# Altium schematic sheet USB_UART_V1.4úĘ1úę.SchDoc
size A4
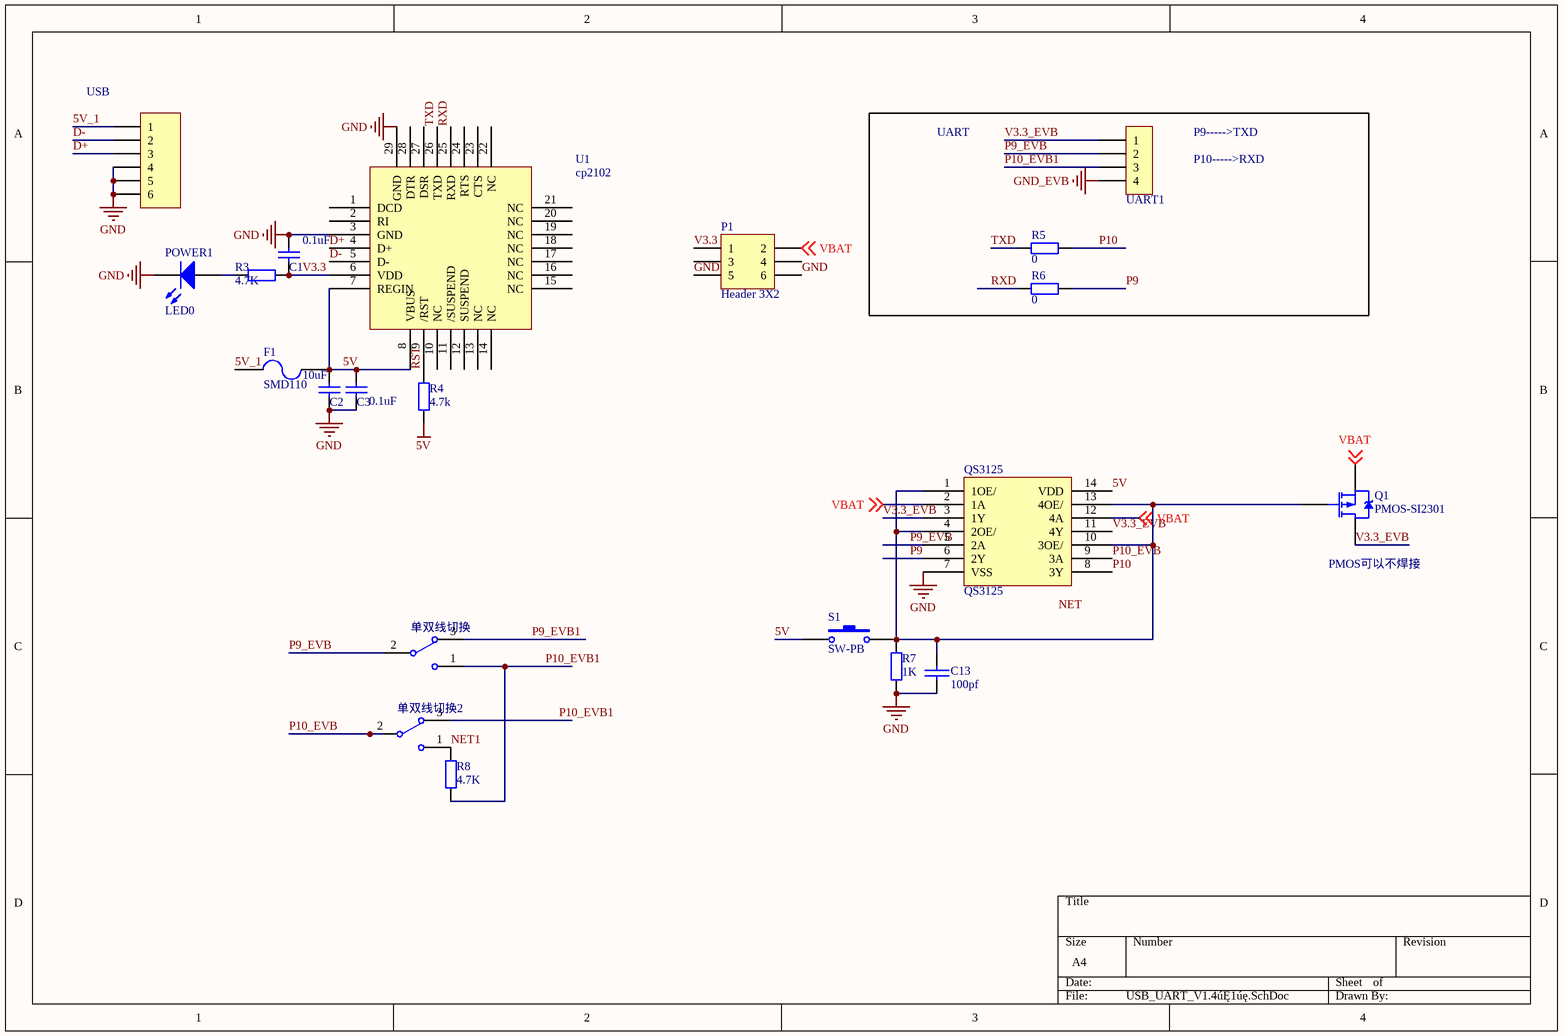
[diagram p0: USB_UART_V1.4úĘ1úę.SchDoc]

## Parts
C1  0.1uF  [C0603]
C2  10uF  [C0603]
C3  0.1uF  [C0603]
C13  100pf  [C0603]
F1  SMD110  [1812]
P1  Header 3X2  [HDR2X3]
POWER1  LED0  [LED0603]
Q1  PMOS-SI2301  [Pmos si2301]
QS3125  QS3125
R3  4.7K  [C0603]
R4  4.7k  [C0603]
R5  value 0  [C0603]  (hidden comment: 4.7k)
R6  value 0  [C0603]  (hidden comment: 4.7k)
R7  value 1K  [C0603]  (hidden comment: 4.7k)
R8  4.7k  [C0603]
S1  SW-PB  [SPST-2]
U1  cp2102  [CP2102]
UART1  CON4  [HDR1X4]  (value not drawn)
USB  MHDR1X6  [USB 公口]  (value not drawn)
单双线切换  SW-SPDT  [HDR1X3]  (value not drawn)
单双线切换2  SW-SPDT  [HDR1X3]  (value not drawn)

## Nets
5V: C2.2 C3.2 F1.1 QS3125.14(VDD) R4.1 S1.1 U1.7(REGIN) U1.8(VBUS)
GND: C1.2 C2.1 C3.1 C13.2 P1.5 P1.6 POWER1.2(K) QS3125.7(VSS) R7.2 U1.3(GND) U1.29(GND) USB.4 USB.5 USB.6
GND_EVB: UART1.4
5V_1: F1.2 USB.1
D+: U1.4(D+) USB.3
D-: U1.5(D-) USB.2
NET1: R8.1 单双线切换2.1
P9: QS3125.6(2Y) R6.2
P9_EVB: QS3125.5(2A) UART1.2 单双线切换.2
P9_EVB1: 单双线切换.3
P10: QS3125.8(3Y) R5.1
P10_EVB: QS3125.9(3A) 单双线切换2.2
P10_EVB1: R8.2 UART1.3 单双线切换.1 单双线切换2.3
RST: R4.2 U1.9(/RST)
RXD: R6.1 U1.25(RXD)
TXD: R5.2 U1.26(TXD)
V3.3: C1.1 P1.1 R3.2 U1.6(VDD)
V3.3_EVB: Q1.2(D) QS3125.3(1Y) QS3125.11(4Y) UART1.1
VBAT: P1.2 Q1.3(S) QS3125.2(1A) QS3125.12(4A) ; off-sheet VBAT
NetC13_1: C13.1 Q1.1(G) QS3125.1(1OE/) QS3125.4(2OE/) QS3125.10(3OE/) QS3125.13(4OE/) R7.1 S1.2
NetPOWER1_1: POWER1.1(A) R3.1

Not connected (* = marked no-connect by the designer): P1 3 4; U1 1(DCD) 2(RI) 10(NC) 11(/SUSPEND) 12(SUSPEND) 13(NC) 14(NC) 15(NC) 16(NC) 17(NC) 18(NC) 19(NC) 20(NC) 21(NC) 22(NC) 23(CTS) 24(RTS) 27(DSR) 28(DTR)

## Notes on the sheet
- UART
- P9----->TXD
- P10----->RXD
- (near Q1) PMOS可以不焊接
- Labels drawn without touching a wire or pin: NET

## Library data of the parts
C1-C3 = Cap: Capacitor; Value: 100pF; Published: 8-Jun-2000; LatestRevisionDate: 17-Jul-2002; LatestRevisionNote: Re-released for DXP Platform.; PackageReference: RAD-0.3; Publisher: Altium Limited; PackageDescription: Radial Cap, Thru-Hole; 2 Leads; 0.3 in Pin Spacing
C13 = 电容瓷片
F1 = FUSE2: Fuse
P1 = Header 3X2: Header, 3-Pin, Dual row; LatestRevisionDate: 17-Jul-2002; LatestRevisionNote: Re-released for DXP Platform.; Publisher: Altium Limited
POWER1 = LED0: Typical INFRARED GaAs LED; Published: 8-Jun-2000; LatestRevisionDate: 08-Jul-2005; LatestRevisionNote: Mech Layer 1 removed.; PackageReference: LED-0; Publisher: Altium Limited; PackageDescription: LED; 2 Leads
Q1 = PMOS-2: P-Channel Power MOSFET; Note: Pin 4 not drawn and electrically connected to Pin 2.; Published: 8-Jun-2000; LatestRevisionDate: 17-Jul-2002; LatestRevisionNote: Re-released for DXP Platform.; DatasheetVersion: PD-9.390D; PackageVersion: Feb-1997; PackageReference: TO-220AB; Publisher: Altium Limited; PackageDescription: TO, Thru-Hole, Vertical, Heatsink Mounted; 3 In-Line Leads; Pitch 2.54 mm; ComponentLink1Description: Manufacturer Link; ComponentLink1URL: http://www.irf.com/
R3-R8 = Res2: Resistor; Published: 8-Jun-2000; LatestRevisionDate: 17-Jul-2002; LatestRevisionNote: Re-released for DXP Platform.; PackageReference: AXIAL-0.4; Publisher: Altium Limited; PackageDescription: Axial Device, Thru-Hole; 2 Leads; 0.4 in Pin Spacing
  R3 R8: Value: 4.7K
  R4: Value: 4.7k
S1 = SW-PB: Switch; Published: 24-Mar-1999; LatestRevisionDate: 17-Jul-2002; LatestRevisionNote: Re-released for DXP Platform.; PackageReference: SPST-2; Publisher: Altium Limited; PackageDescription: Switch; 2 Leads
USB = MHDR1X6: Header, 6-Pin; LatestRevisionDate: 17-Jul-2002; LatestRevisionNote: Re-released for DXP Platform.; Publisher: Altium Limited
单双线切换 单双线切换2 = SW-SPDT: SPDT Subminiature Toggle Switch, Right Angle Mounting, Vertical Actuation; Published: 24-Mar-1999; LatestRevisionDate: 17-Dec-2003; LatestRevisionNote: Schematic revised, PCB Footprint replaced.; DatasheetVersion: 05-Dec-2000; PackageReference: TL36WW15050; Publisher: Altium Limited; PackageDescription: Switch; 4 Leads; ComponentLink1Description: Manufacturer Link; ComponentLink1URL: http://www.apem.com